# Altium schematic sheet XTX.SchDoc
size C
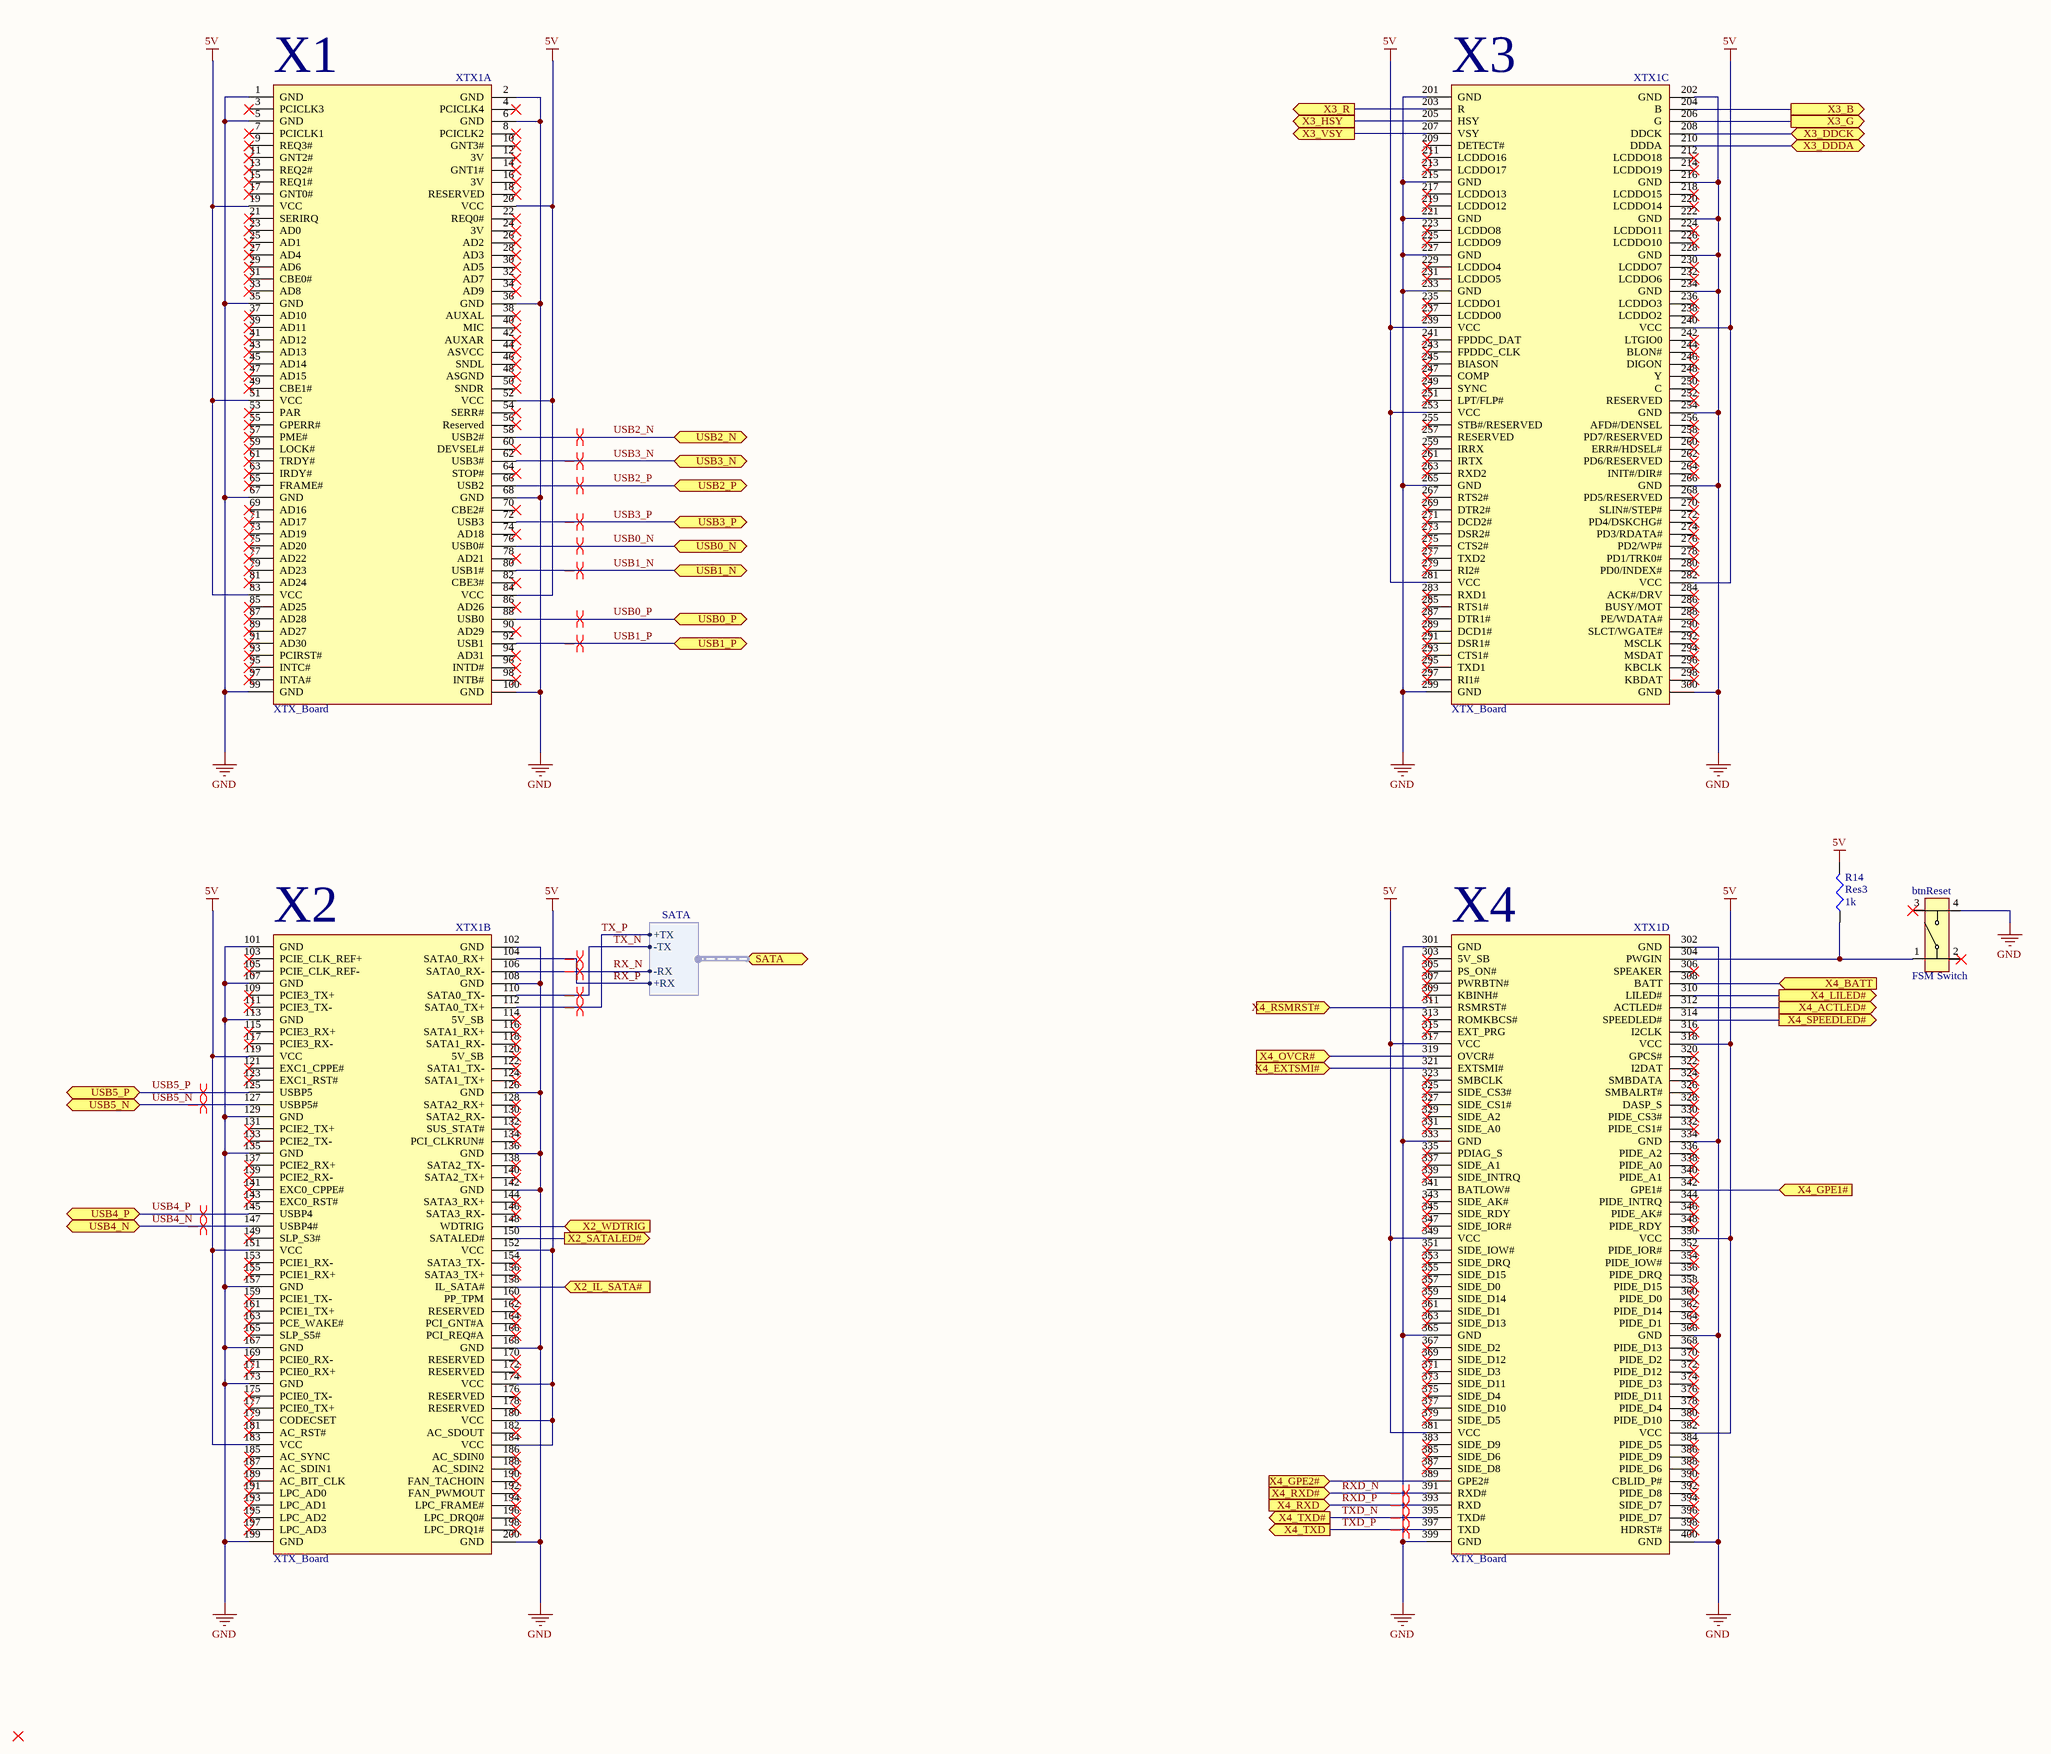
[diagram p0: XTX.SchDoc]

## Parts
btnReset  FSM Switch  [FSM4JH]
R14  Res3  value 1k  [J1-0603]
XTX1  XTX_Board  [XTX_Board]  (parts A,B,C,D of 4)

## Ports
SATA (harness SATA), USB0_N (bidir), USB0_P (bidir), USB1_N (bidir), USB1_P (bidir), USB2_N (bidir), USB2_P (bidir), USB3_N (bidir), USB3_P (bidir), USB4_N (bidir), USB4_P (bidir), USB5_N (bidir), USB5_P (bidir), X2_IL_SATA# (in), X2_SATALED# (out), X2_WDTRIG (in), X3_B (out), X3_DDCK (bidir), X3_DDDA (bidir), X3_G (out), X3_HSY (out), X3_R (out), X3_VSY (out), X4_ACTLED# (out), X4_BATT (in), X4_EXTSMI# (in), X4_GPE1# (in), X4_GPE2# (in), X4_LILED# (out), X4_OVCR# (in), X4_RSMRST# (in), X4_RXD (in), X4_RXD# (in), X4_SPEEDLED# (out), X4_TXD (out), X4_TXD# (out)

## Harnesses
SATA: +TX, -TX, -RX, +RX

## Nets
5V: R14.2 XTX1.19(VCC) XTX1.20(VCC) XTX1.51(VCC) XTX1.52(VCC) XTX1.83(VCC) XTX1.84(VCC) XTX1.119(VCC) XTX1.151(VCC) XTX1.152(VCC) XTX1.174(VCC) XTX1.180(VCC) XTX1.183(VCC) XTX1.184(VCC) XTX1.239(VCC) XTX1.240(VCC) XTX1.253(VCC) XTX1.281(VCC) XTX1.282(VCC) XTX1.317(VCC) XTX1.318(VCC) XTX1.349(VCC) XTX1.350(VCC) XTX1.381(VCC) XTX1.382(VCC)
GND: btnReset.4 XTX1.1(GND) XTX1.2(GND) XTX1.5(GND) XTX1.6(GND) XTX1.35(GND) XTX1.36(GND) XTX1.67(GND) XTX1.68(GND) XTX1.99(GND) XTX1.100(GND) XTX1.101(GND) XTX1.102(GND) XTX1.107(GND) XTX1.108(GND) XTX1.113(GND) XTX1.126(GND) XTX1.129(GND) XTX1.135(GND) XTX1.136(GND) XTX1.142(GND) XTX1.157(GND) XTX1.167(GND) XTX1.168(GND) XTX1.173(GND) XTX1.199(GND) XTX1.200(GND) XTX1.201(GND) XTX1.202(GND) XTX1.215(GND) XTX1.216(GND) XTX1.221(GND) XTX1.222(GND) XTX1.227(GND) XTX1.228(GND) XTX1.233(GND) XTX1.234(GND) XTX1.254(GND) XTX1.265(GND) XTX1.266(GND) XTX1.299(GND) XTX1.300(GND) XTX1.301(GND) XTX1.302(GND) XTX1.333(GND) XTX1.334(GND) XTX1.365(GND) XTX1.366(GND) XTX1.399(GND) XTX1.400(GND)
RX_N: XTX1.106(SATA0_RX-) ; port SATA.-RX
RX_P: XTX1.104(SATA0_RX+) ; port SATA.+RX
RXD_N: XTX1.391(RXD#) ; port X4_RXD#
RXD_P: XTX1.393(RXD) ; port X4_RXD
TX_N: XTX1.110(SATA0_TX-) ; port SATA.-TX
TX_P: XTX1.112(SATA0_TX+) ; port SATA.+TX
TXD_N: XTX1.395(TXD#) ; port X4_TXD#
TXD_P: XTX1.397(TXD) ; port X4_TXD
USB0_N: XTX1.76(USB0#) ; port USB0_N
USB0_P: XTX1.88(USB0) ; port USB0_P
USB1_N: XTX1.80(USB1#) ; port USB1_N
USB1_P: XTX1.92(USB1) ; port USB1_P
USB2_N: XTX1.58(USB2#) ; port USB2_N
USB2_P: XTX1.66(USB2) ; port USB2_P
USB3_N: XTX1.62(USB3#) ; port USB3_N
USB3_P: XTX1.72(USB3) ; port USB3_P
USB4_N: XTX1.147(USBP4#) ; port USB4_N
USB4_P: XTX1.145(USBP4) ; port USB4_P
USB5_N: XTX1.127(USBP5#) ; port USB5_N
USB5_P: XTX1.125(USBP5) ; port USB5_P
X2_IL_SATA#: XTX1.158(IL_SATA#) ; port X2_IL_SATA#
X2_SATALED#: XTX1.150(SATALED#) ; port X2_SATALED#
X2_WDTRIG: XTX1.148(WDTRIG) ; port X2_WDTRIG
X3_B: XTX1.204(B) ; port X3_B
X3_DDCK: XTX1.208(DDCK) ; port X3_DDCK
X3_DDDA: XTX1.210(DDDA) ; port X3_DDDA
X3_G: XTX1.206(G) ; port X3_G
X3_HSY: XTX1.205(HSY) ; port X3_HSY
X3_R: XTX1.203(R) ; port X3_R
X3_VSY: XTX1.207(VSY) ; port X3_VSY
X4_ACTLED#: XTX1.312(ACTLED#) ; port X4_ACTLED#
X4_BATT: XTX1.308(BATT) ; port X4_BATT
X4_EXTSMI#: XTX1.321(EXTSMI#) ; port X4_EXTSMI#
X4_GPE1#: XTX1.342(GPE1#) ; port X4_GPE1#
X4_GPE2#: XTX1.389(GPE2#) ; port X4_GPE2#
X4_LILED#: XTX1.310(LILED#) ; port X4_LILED#
X4_OVCR#: XTX1.319(OVCR#) ; port X4_OVCR#
X4_RSMRST#: XTX1.311(RSMRST#) ; port X4_RSMRST#
X4_SPEEDLED#: XTX1.314(SPEEDLED#) ; port X4_SPEEDLED#
NetbtnReset_1: btnReset.1 R14.1 XTX1.304(PWGIN)

Not connected (* = marked no-connect by the designer): btnReset 2* 3*; XTX1 3(PCICLK3)* 4(PCICLK4)* 7(PCICLK1)* 8(PCICLK2)* 9(REQ3#)* 10(GNT3#)* 11(GNT2#)* 12(3V)* 13(REQ2#)* 14(GNT1#)* 15(REQ1#)* 16(3V)* 17(GNT0#)* 18(RESERVED)* 21(SERIRQ)* 22(REQ0#)* 23(AD0)* 24(3V)* 25(AD1)* 26(AD2)* 27(AD4)* 28(AD3)* 29(AD6)* 30(AD5)* 31(CBE0#)* 32(AD7)* 33(AD8)* 34(AD9)* 37(AD10)* 38(AUXAL)* 39(AD11)* 40(MIC)* 41(AD12)* 42(AUXAR)* 43(AD13)* 44(ASVCC)* 45(AD14)* 46(SNDL)* 47(AD15)* 48(ASGND)* 49(CBE1#)* 50(SNDR)* 53(PAR)* 54(SERR#)* 55(GPERR#)* 56(Reserved)* 57(PME#)* 59(LOCK#)* 60(DEVSEL#)* 61(TRDY#)* 63(IRDY#)* 64(STOP#)* 65(FRAME#)* 69(AD16)* 70(CBE2#)* 71(AD17)* 73(AD19)* 74(AD18)* 75(AD20)* 77(AD22)* 78(AD21)* 79(AD23)* 81(AD24)* 82(CBE3#)* 85(AD25)* 86(AD26)* 87(AD28)* 89(AD27)* 90(AD29)* 91(AD30)* 93(PCIRST#)* 94(AD31)* 95(INTC#)* 96(INTD#)* 97(INTA#)* 98(INTB#)* 103(PCIE_CLK_REF+)* 105(PCIE_CLK_REF-)* 109(PCIE3_TX+)* 111(PCIE3_TX-)* 114(5V_SB)* 115(PCIE3_RX+)* 116(SATA1_RX+)* 117(PCIE3_RX-)* 118(SATA1_RX-)* 120(5V_SB)* 121(EXC1_CPPE#)* 122(SATA1_TX-)* 123(EXC1_RST#)* 124(SATA1_TX+)* 128(SATA2_RX+)* 130(SATA2_RX-)* 131(PCIE2_TX+)* 132(SUS_STAT#)* 133(PCIE2_TX-)* 134(PCI_CLKRUN#)* 137(PCIE2_RX+)* 138(SATA2_TX-)* 139(PCIE2_RX-)* 140(SATA2_TX+)* 141(EXC0_CPPE#)* 143(EXC0_RST#)* 144(SATA3_RX+)* 146(SATA3_RX-)* 149(SLP_S3#)* 153(PCIE1_RX-)* 154(SATA3_TX-)* 155(PCIE1_RX+)* 156(SATA3_TX+)* 159(PCIE1_TX-)* 160(PP_TPM)* 161(PCIE1_TX+)* 162(RESERVED)* 163(PCE_WAKE#)* 164(PCI_GNT#A)* 165(SLP_S5#)* 166(PCI_REQ#A)* 169(PCIE0_RX-)* 170(RESERVED)* 171(PCIE0_RX+)* 172(RESERVED)* 175(PCIE0_TX-)* 176(RESERVED)* 177(PCIE0_TX+)* 178(RESERVED)* 179(CODECSET)* 181(AC_RST#)* 182(AC_SDOUT)* 185(AC_SYNC)* 186(AC_SDIN0)* 187(AC_SDIN1)* 188(AC_SDIN2)* 189(AC_BIT_CLK)* 190(FAN_TACHOIN)* 191(LPC_AD0)* 192(FAN_PWMOUT)* 193(LPC_AD1)* 194(LPC_FRAME#)* 195(LPC_AD2)* 196(LPC_DRQ0#)* 197(LPC_AD3)* 198(LPC_DRQ1#)* 209(DETECT#)* 211(LCDDO16)* 212(LCDDO18)* 213(LCDDO17)* 214(LCDDO19)* 217(LCDDO13)* 218(LCDDO15)* 219(LCDDO12)* 220(LCDDO14)* 223(LCDDO8)* 224(LCDDO11)* 225(LCDDO9)* 226(LCDDO10)* 229(LCDDO4)* 230(LCDDO7)* 231(LCDDO5)* 232(LCDDO6)* 235(LCDDO1)* 236(LCDDO3)* 237(LCDDO0)* 238(LCDDO2)* 241(FPDDC_DAT)* 242(LTGIO0)* 243(FPDDC_CLK)* 244(BLON#)* 245(BIASON)* 246(DIGON)* 247(COMP)* 248(Y)* 249(SYNC)* 250(C)* 251(LPT/FLP#)* 252(RESERVED)* 255(STB#/RESERVED)* 256(AFD#/DENSEL)* 257(RESERVED) 258(PD7/RESERVED)* 259(IRRX)* 260(ERR#/HDSEL#)* 261(IRTX)* 262(PD6/RESERVED)* 263(RXD2)* 264(INIT#/DIR#)* 267(RTS2#)* 268(PD5/RESERVED)* 269(DTR2#)* 270(SLIN#/STEP#)* 271(DCD2#)* 272(PD4/DSKCHG#)* 273(DSR2#)* 274(PD3/RDATA#)* 275(CTS2#)* 276(PD2/WP#)* 277(TXD2)* 278(PD1/TRK0#)* 279(RI2#)* 280(PD0/INDEX#)* 283(RXD1)* 284(ACK#/DRV)* 285(RTS1#)* 286(BUSY/MOT)* 287(DTR1#)* 288(PE/WDATA#)* 289(DCD1#)* 290(SLCT/WGATE#)* 291(DSR1#)* 292(MSCLK)* 293(CTS1#)* 294(MSDAT)* 295(TXD1)* 296(KBCLK)* 297(RI1#)* 298(KBDAT)* 303(5V_SB)* 305(PS_ON#)* 306(SPEAKER)* 307(PWRBTN#)* 309(KBINH#)* 313(ROMKBCS#)* 315(EXT_PRG)* 316(I2CLK)* 320(GPCS#)* 322(I2DAT)* 323(SMBCLK)* 324(SMBDATA)* 325(SIDE_CS3#)* 326(SMBALRT#)* 327(SIDE_CS1#)* 328(DASP_S)* 329(SIDE_A2)* 330(PIDE_CS3#)* 331(SIDE_A0)* 332(PIDE_CS1#)* 335(PDIAG_S)* 336(PIDE_A2)* 337(SIDE_A1)* 338(PIDE_A0)* 339(SIDE_INTRQ)* 340(PIDE_A1)* 341(BATLOW#) 343(SIDE_AK#)* 344(PIDE_INTRQ)* 345(SIDE_RDY)* 346(PIDE_AK#)* 347(SIDE_IOR#)* 348(PIDE_RDY)* 351(SIDE_IOW#)* 352(PIDE_IOR#)* 353(SIDE_DRQ)* 354(PIDE_IOW#)* 355(SIDE_D15)* 356(PIDE_DRQ) 357(SIDE_D0)* 358(PIDE_D15)* 359(SIDE_D14)* 360(PIDE_D0)* 361(SIDE_D1)* 362(PIDE_D14)* 363(SIDE_D13)* 364(PIDE_D1)* 367(SIDE_D2)* 368(PIDE_D13)* 369(SIDE_D12)* 370(PIDE_D2)* 371(SIDE_D3)* 372(PIDE_D12)* 373(SIDE_D11)* 374(PIDE_D3)* 375(SIDE_D4)* 376(PIDE_D11)* 377(SIDE_D10)* 378(PIDE_D4)* 379(SIDE_D5)* 380(PIDE_D10)* 383(SIDE_D9)* 384(PIDE_D5)* 385(SIDE_D6)* 386(PIDE_D9)* 387(SIDE_D8)* 388(PIDE_D6)* 390(CBLID_P#)* 392(PIDE_D8)* 394(SIDE_D7)* 396(PIDE_D7)* 398(HDRST#)*

## Layout directives
differential pair: RX_N, RX_P, RXD_N, RXD_P, TX_N, TX_P, TXD_N, TXD_P, USB0_N, USB0_P, USB1_N, USB1_P, USB2_N, USB2_P, USB3_N, USB3_P, USB4_N, USB4_P, USB5_N, USB5_P

## Notes on the sheet
- (in symbol XTX_Board, part A) X1
- (in symbol XTX_Board, part B) X2
- (in symbol XTX_Board, part C) X3
- (in symbol XTX_Board, part D) X4

## Library data of the parts
btnReset = FSM Switch: FSM 6mm Series Switch; Supplier Part #: 450-1650-ND; Supplier: DigiKey
R14 = Res3: Resistor; Published: 8-Jun-2000; LatestRevisionDate: 04-Mar-2005; LatestRevisionNote: PCB Footprint replaced.; PackageReference: J1-0603; Publisher: Altium Limited; Supplier Part #: P100KGCT-ND; Supplier: DigiKey
XTX1 = XTX_Board: Datasheet: http://www.xtx-standard.org/fileadmin/documents/XTX-Spec12.pdf